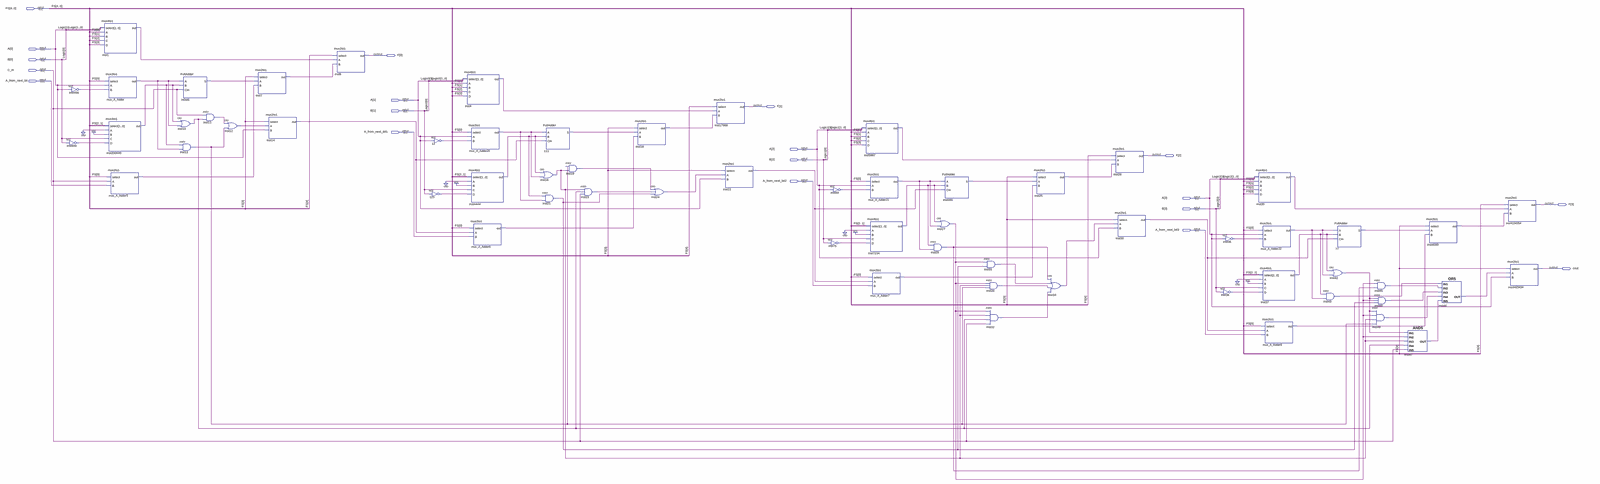
[diagram p0: schematic sheet, whole]
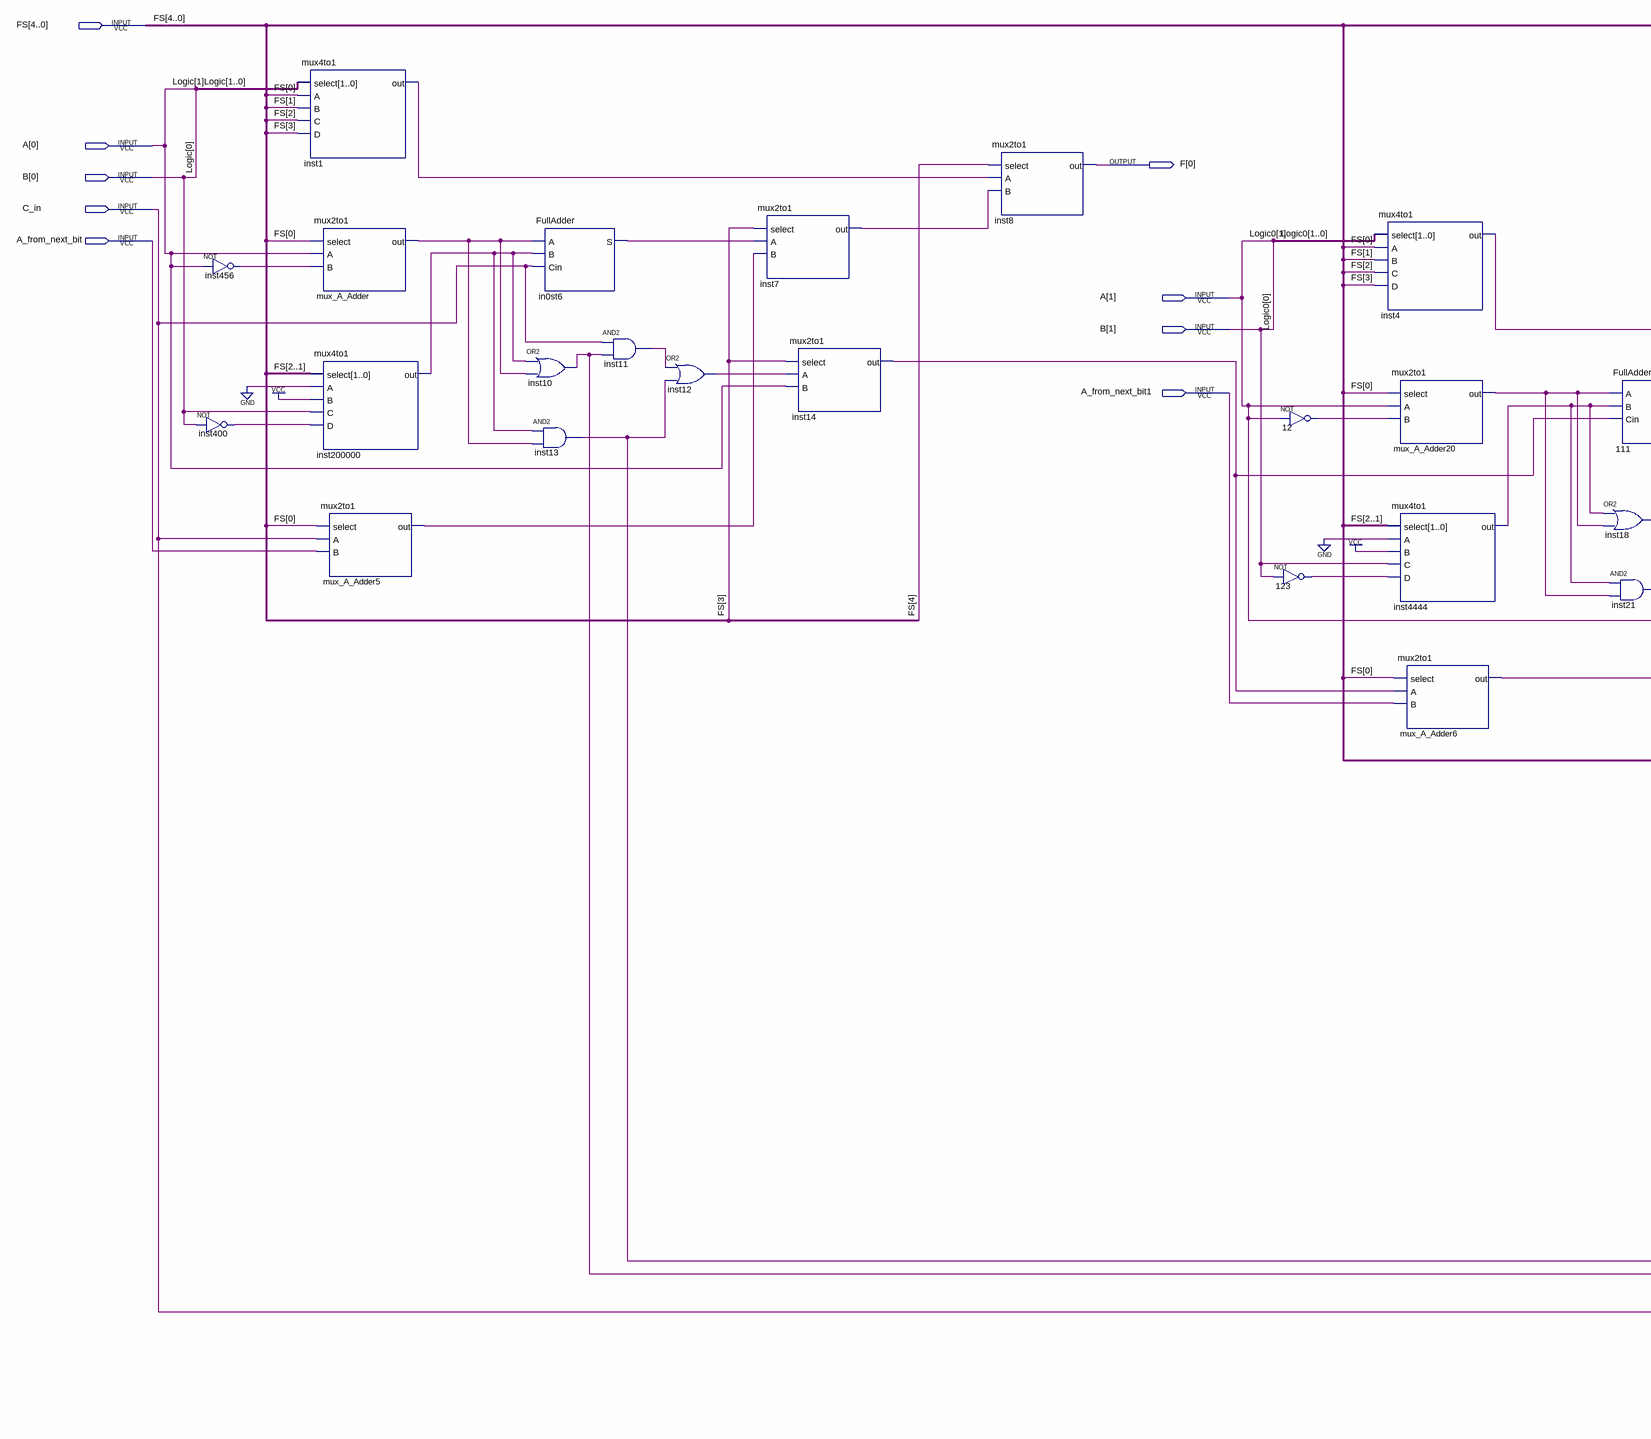
[diagram p1: schematic sheet, left part]
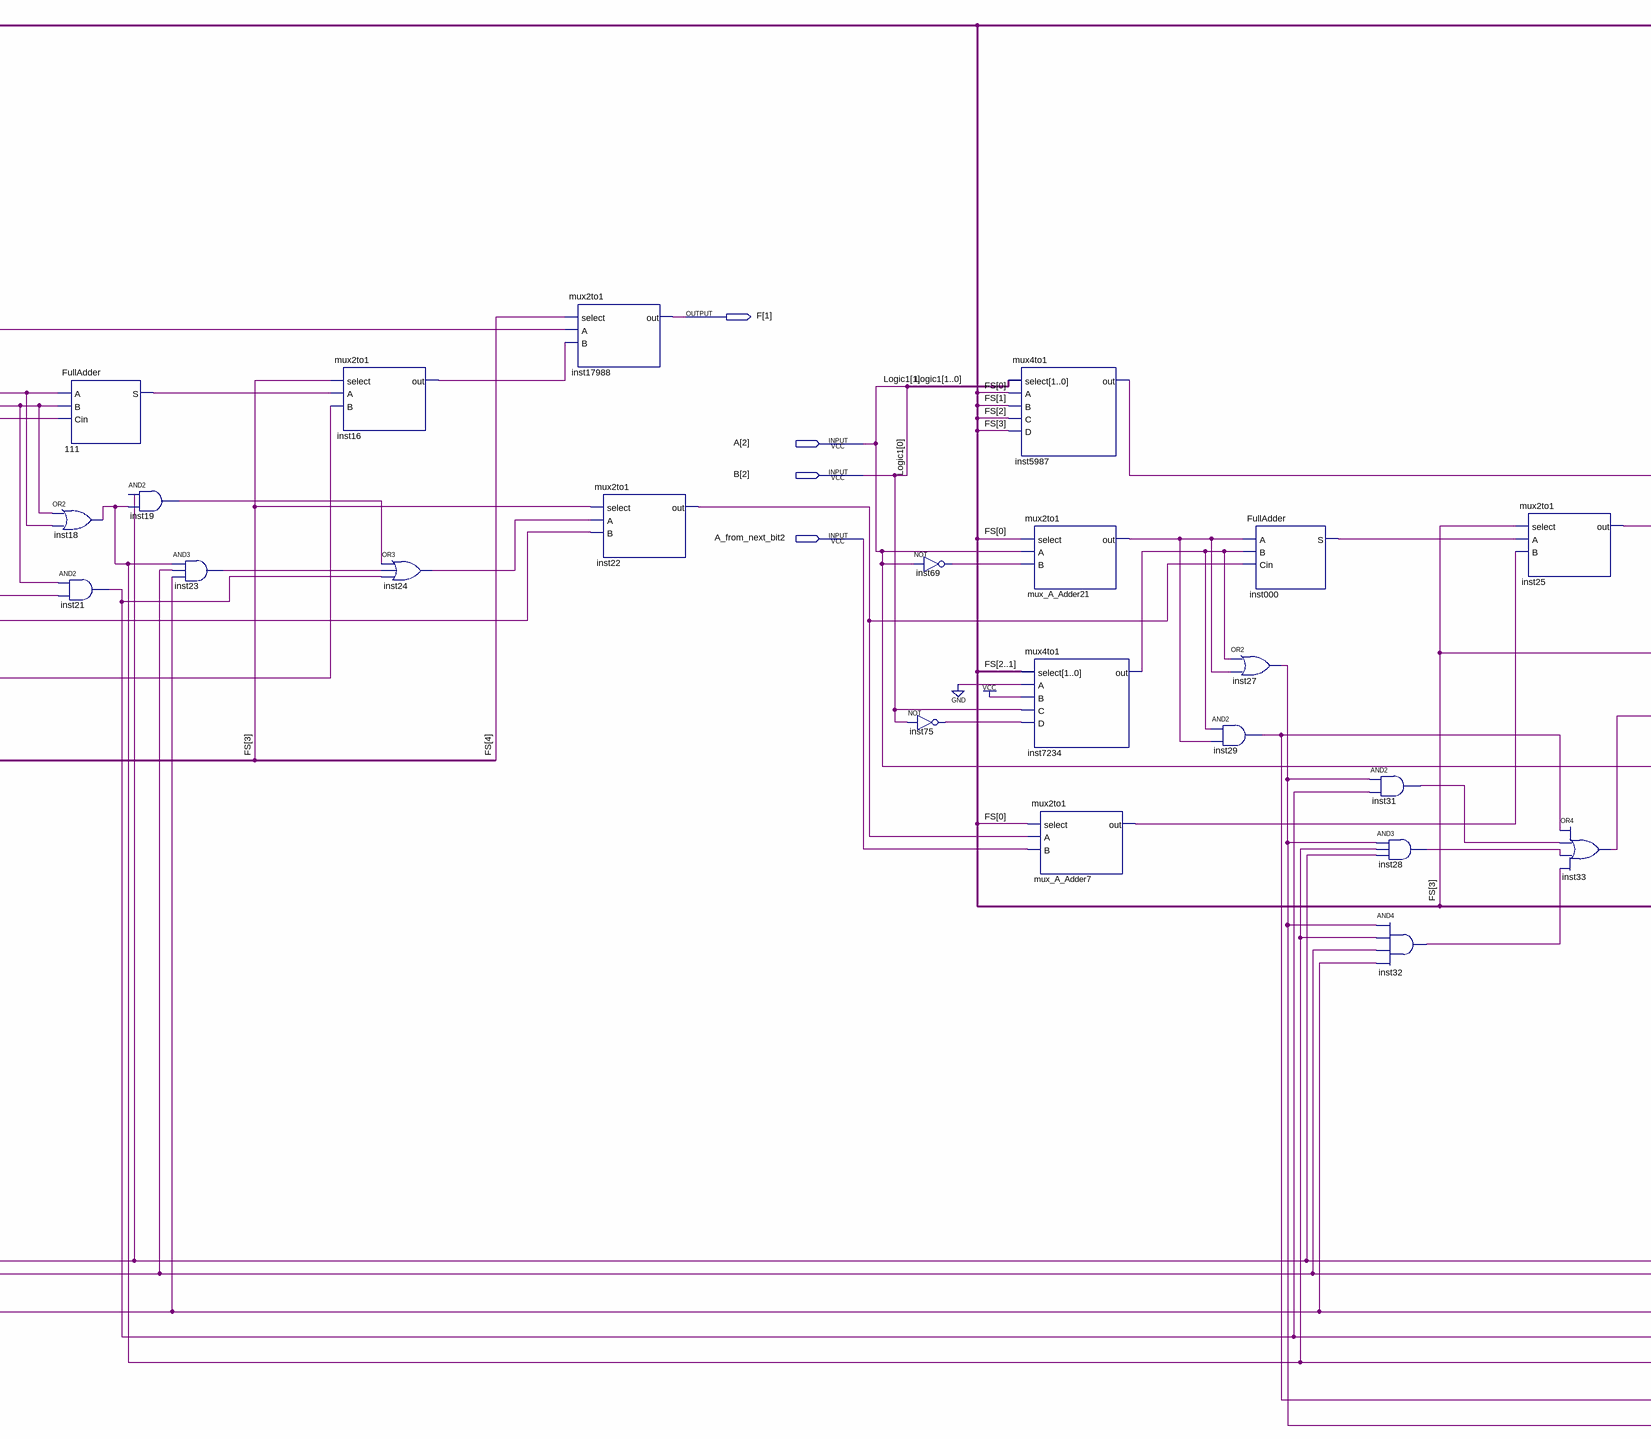
[diagram p2: schematic sheet, centre part]
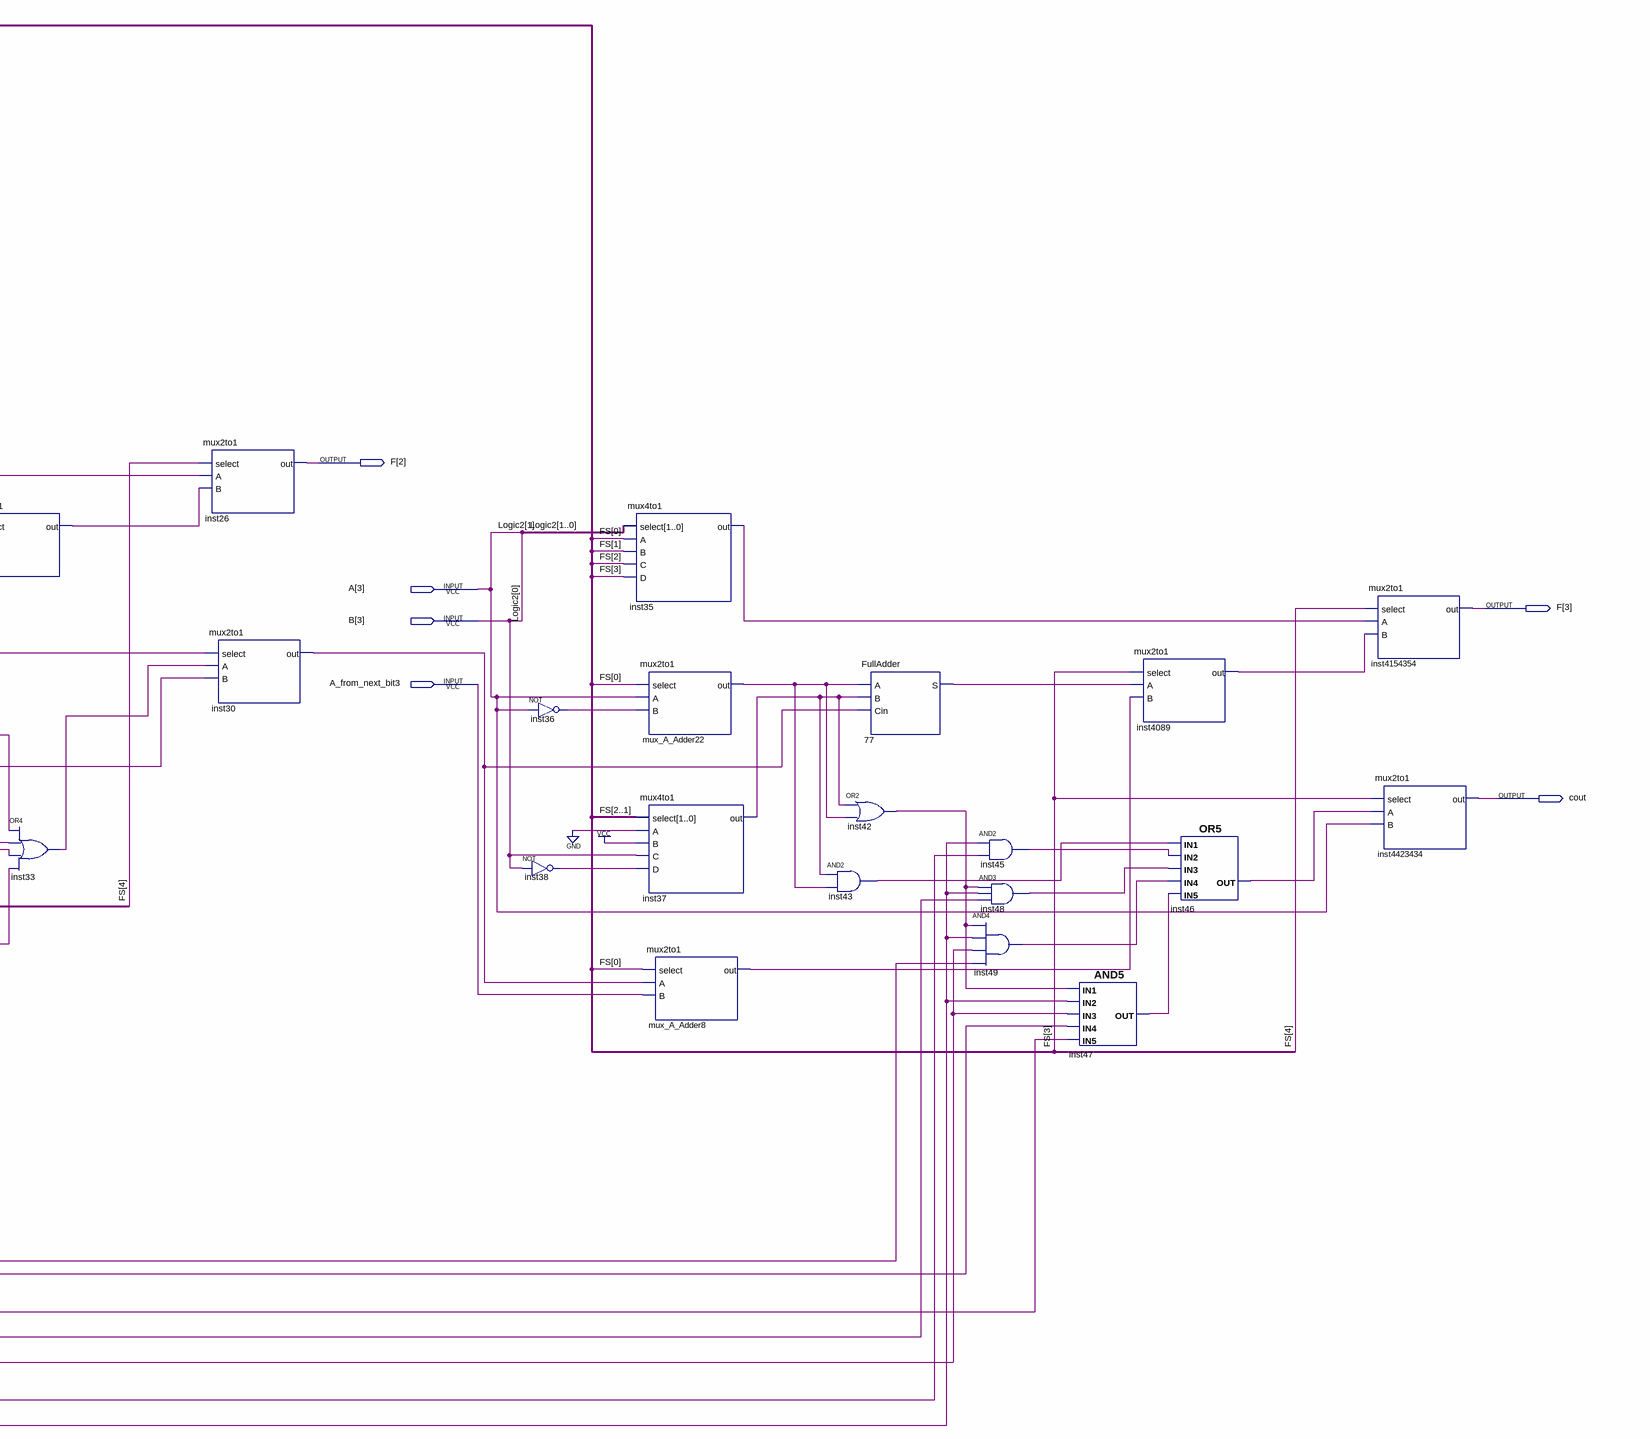
[diagram p3: schematic sheet, right part]
// Quartus schematic ALU.bdf as structural Verilog: 62 symbols, 19 pins
module ALU (
  input  [4:0] FS,
  input  [3:0] A,
  input  [3:0] B,
  input  C_in,
  input  A_from_next_bit,
  input  A_from_next_bit1,
  input  A_from_next_bit2,
  input  A_from_next_bit3,
  output [3:0] F,
  output cout
);

  wire in0st6_s, inst000_s, inst1_out, inst4_out, inst7_out, inst10_out, inst11_out, inst12_out, inst13_out,
       inst14_out, inst16_out, inst18_out, inst19_out, inst21_out, inst22_out, inst23_out, inst24_out,
       inst25_out, inst27_out, inst28_out, inst29_out, inst30_out, inst31_out, inst32_out, inst33_out,
       inst35_out, inst36_out, inst37_out, inst38_out, inst42_out, inst43_out, inst45_out, inst46_out,
       inst47_out, inst48_out, inst49_out, inst69_out, inst75_out, inst400_out, inst456_out, inst4089_out,
       inst4444_out, inst5987_out, inst7234_out, inst200000_out, mux_A_Adder5_out, mux_A_Adder6_out,
       mux_A_Adder7_out, mux_A_Adder8_out, mux_A_Adder20_out, mux_A_Adder21_out, mux_A_Adder22_out,
       mux_A_Adder_out, n12_out, n77_s, n111_s, n123_out;

  not inst456 (inst456_out, A[0]);
  not inst400 (inst400_out, B[0]);
  mux4to1 inst1 (.select({A[0], B[0]}), .A(FS[0]), .B(FS[1]), .C(FS[2]), .D(FS[3]), .out(inst1_out));
  mux2to1 mux_A_Adder (.select(FS[0]), .A(A[0]), .B(inst456_out), .out(mux_A_Adder_out));
  mux4to1 inst200000 (.select(FS[2:1]), .A(1'b0), .B(1'b1), .C(B[0]), .D(inst400_out), .out(inst200000_out));
  mux2to1 mux_A_Adder5 (.select(FS[0]), .A(C_in), .B(A_from_next_bit), .out(mux_A_Adder5_out));
  FullAdder in0st6 (.A(mux_A_Adder_out), .B(inst200000_out), .Cin(C_in), .S(in0st6_s));
  or inst10 (inst10_out, inst200000_out, mux_A_Adder_out);
  and inst13 (inst13_out, inst200000_out, mux_A_Adder_out);
  and inst11 (inst11_out, C_in, inst10_out);
  or inst12 (inst12_out, inst11_out, inst13_out);
  mux2to1 inst7 (.select(FS[3]), .A(in0st6_s), .B(mux_A_Adder5_out), .out(inst7_out));
  mux2to1 inst14 (.select(FS[3]), .A(inst12_out), .B(A[0]), .out(inst14_out));
  mux2to1 inst8 (.select(FS[4]), .A(inst1_out), .B(inst7_out), .out(F[0]));
  not u_12 (n12_out, A[1]);
  not u_123 (n123_out, B[1]);
  mux4to1 inst4 (.select({A[1], B[1]}), .A(FS[0]), .B(FS[1]), .C(FS[2]), .D(FS[3]), .out(inst4_out));
  mux2to1 mux_A_Adder20 (.select(FS[0]), .A(A[1]), .B(n12_out), .out(mux_A_Adder20_out));
  mux4to1 inst4444 (.select(FS[2:1]), .A(1'b0), .B(1'b1), .C(B[1]), .D(n123_out), .out(inst4444_out));
  mux2to1 mux_A_Adder6 (.select(FS[0]), .A(inst14_out), .B(A_from_next_bit1), .out(mux_A_Adder6_out));
  FullAdder u_111 (.A(mux_A_Adder20_out), .B(inst4444_out), .Cin(inst14_out), .S(n111_s));
  or inst18 (inst18_out, inst4444_out, mux_A_Adder20_out);
  and inst21 (inst21_out, inst4444_out, mux_A_Adder20_out);
  and inst19 (inst19_out, inst13_out, inst18_out);
  and inst23 (inst23_out, inst18_out, inst10_out, C_in);
  mux2to1 inst16 (.select(FS[3]), .A(n111_s), .B(mux_A_Adder6_out), .out(inst16_out));
  or inst24 (inst24_out, inst19_out, inst23_out, inst21_out);
  mux2to1 inst17988 (.select(FS[4]), .A(inst4_out), .B(inst16_out), .out(F[1]));
  mux2to1 inst22 (.select(FS[3]), .A(inst24_out), .B(A[1]), .out(inst22_out));
  not inst69 (inst69_out, A[2]);
  not inst75 (inst75_out, B[2]);
  mux4to1 inst5987 (.select({A[2], B[2]}), .A(FS[0]), .B(FS[1]), .C(FS[2]), .D(FS[3]), .out(inst5987_out));
  mux2to1 mux_A_Adder21 (.select(FS[0]), .A(A[2]), .B(inst69_out), .out(mux_A_Adder21_out));
  mux4to1 inst7234 (.select(FS[2:1]), .A(1'b0), .B(1'b1), .C(B[2]), .D(inst75_out), .out(inst7234_out));
  mux2to1 mux_A_Adder7 (.select(FS[0]), .A(inst22_out), .B(A_from_next_bit2), .out(mux_A_Adder7_out));
  FullAdder inst000 (.A(mux_A_Adder21_out), .B(inst7234_out), .Cin(inst22_out), .S(inst000_s));
  or inst27 (inst27_out, inst7234_out, mux_A_Adder21_out);
  and inst29 (inst29_out, inst7234_out, mux_A_Adder21_out);
  and inst31 (inst31_out, inst27_out, inst21_out);
  and inst28 (inst28_out, inst27_out, inst18_out, inst13_out);
  and inst32 (inst32_out, inst27_out, inst18_out, inst10_out, C_in);
  mux2to1 inst25 (.select(FS[3]), .A(inst000_s), .B(mux_A_Adder7_out), .out(inst25_out));
  or inst33 (inst33_out, inst29_out, inst31_out, inst28_out, inst32_out);
  mux2to1 inst26 (.select(FS[4]), .A(inst5987_out), .B(inst25_out), .out(F[2]));
  mux2to1 inst30 (.select(FS[3]), .A(inst33_out), .B(A[2]), .out(inst30_out));
  not inst36 (inst36_out, A[3]);
  not inst38 (inst38_out, B[3]);
  mux4to1 inst35 (.select({A[3], B[3]}), .A(FS[0]), .B(FS[1]), .C(FS[2]), .D(FS[3]), .out(inst35_out));
  mux2to1 mux_A_Adder22 (.select(FS[0]), .A(A[3]), .B(inst36_out), .out(mux_A_Adder22_out));
  mux4to1 inst37 (.select(FS[2:1]), .A(1'b0), .B(1'b1), .C(B[3]), .D(inst38_out), .out(inst37_out));
  mux2to1 mux_A_Adder8 (.select(FS[0]), .A(inst30_out), .B(A_from_next_bit3), .out(mux_A_Adder8_out));
  FullAdder u_77 (.A(mux_A_Adder22_out), .B(inst37_out), .Cin(inst30_out), .S(n77_s));
  or inst42 (inst42_out, inst37_out, mux_A_Adder22_out);
  and inst43 (inst43_out, inst37_out, mux_A_Adder22_out);
  and inst45 (inst45_out, inst27_out, inst29_out);
  and inst48 (inst48_out, inst42_out, inst27_out, inst21_out);
  and inst49 (inst49_out, inst42_out, inst27_out, inst18_out, inst13_out);
  and inst47 (inst47_out, inst42_out, inst27_out, inst18_out, inst10_out, C_in);
  mux2to1 inst4089 (.select(FS[3]), .A(n77_s), .B(mux_A_Adder8_out), .out(inst4089_out));
  or inst46 (inst46_out, inst43_out, inst45_out, inst48_out, inst49_out, inst47_out);
  mux2to1 inst4154354 (.select(FS[4]), .A(inst35_out), .B(inst4089_out), .out(F[3]));
  mux2to1 inst4423434 (.select(FS[3]), .A(inst46_out), .B(A[3]), .out(cout));

  // Other names for the same wires on the sheet: Logic[1:0] = {A[0], B[0]}; Logic0[1:0] = {A[1], B[1]};
  //   Logic1[1:0] = {A[2], B[2]}; Logic2[1:0] = {A[3], B[3]}
endmodule
